# Altium schematic sheet Xiao esp32.SchDoc
size A; SheetNumber: 1; SheetTotal: 1
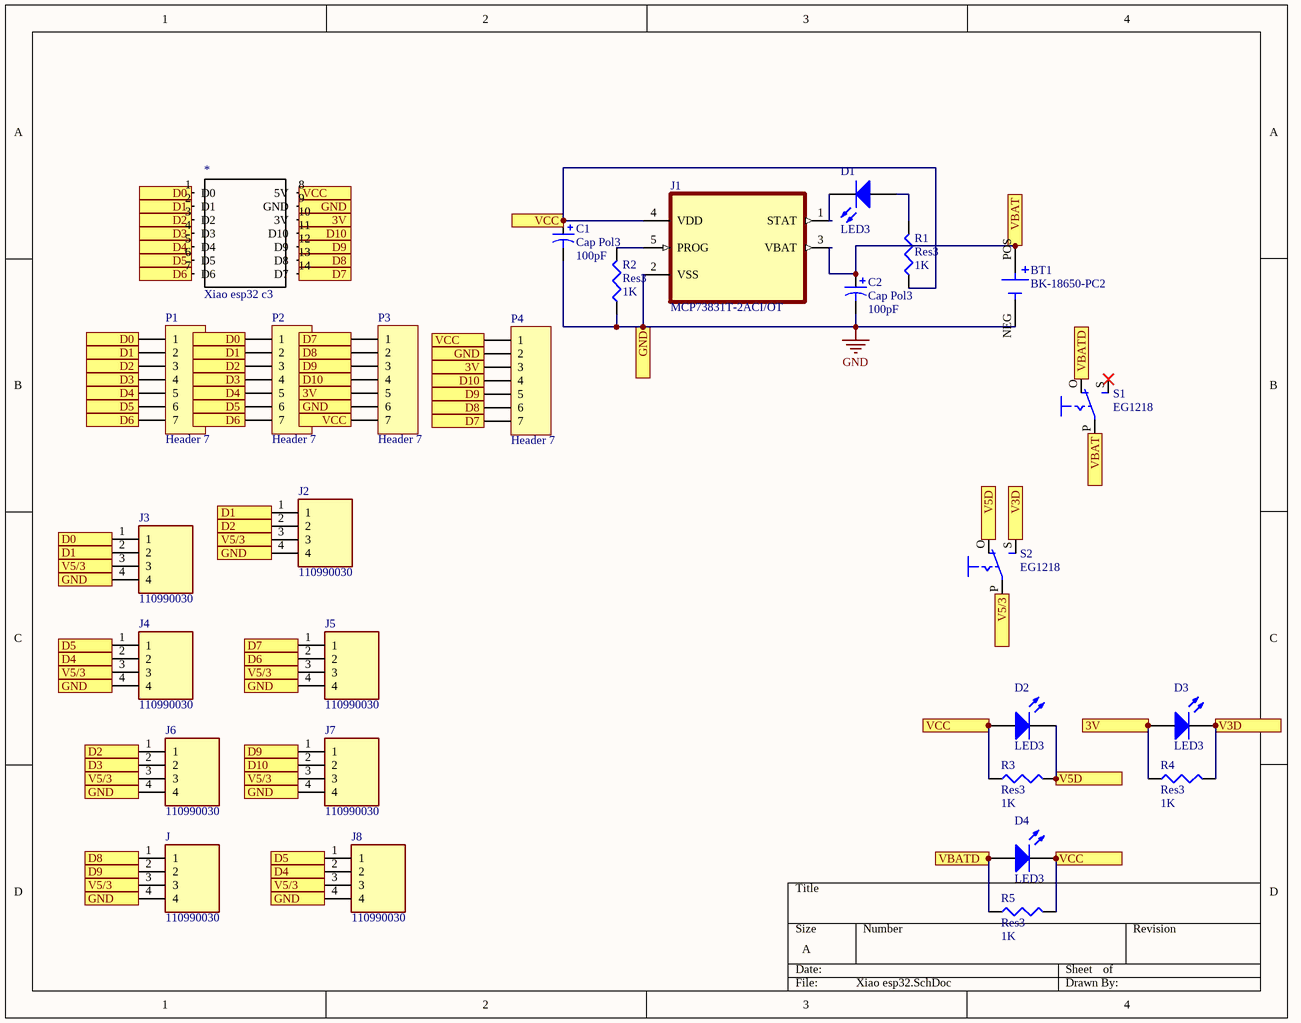
[diagram p0: Xiao esp32.SchDoc]

## Parts
*  Xiao esp32 c3  [Xiao esp32c3]
BT1  BK-18650-PC2  [BAT_BK-18650-PC2]
C1  Cap Pol3  value 100pF  [C0805]
C2  Cap Pol3  value 100pF  [C0805]
D1  LED3  [3.5X2.8X1.9]
D2  LED3  [3.5X2.8X1.9]
D3  LED3  [3.5X2.8X1.9]
D4  LED3  [3.5X2.8X1.9]
J  110990030  [SEEED_110990030]
J1  MCP73831T-2ACI/OT  [SOT95P280X145-5N]
J2  110990030  [SEEED_110990030]
J3  110990030  [SEEED_110990030]
J4  110990030  [SEEED_110990030]
J5  110990030  [SEEED_110990030]
J6  110990030  [SEEED_110990030]
J7  110990030  [SEEED_110990030]
J8  110990030  [SEEED_110990030]
P1  Header 7  [HDR1X7]
P2  Header 7  [HDR1X7]
P3  Header 7  [HDR1X7]
P4  Header 7  [HDR1X7]
R1  Res3  value 1K  [J1-0603]
R2  Res3  value 1K  [J1-0603]
R3  Res3  value 1K  [J1-0603]
R4  Res3  value 1K  [J1-0603]
R5  Res3  value 1K  [J1-0603]
S1  EG1218  [EG1218]
S2  EG1218  [EG1218]

## Ports
3V, D0, D1, D2, D3, D4, D5, D6, D7, D8, D9, D10, GND, V3D, V5/3, V5D, VBAT, VBATD, VCC

## Nets
GND: *.9(GND) BT1.NEG C1.2 C2.2 J.4 J1.2(VSS) J2.4 J3.4 J4.4 J5.4 J6.4 J7.4 J8.4 P3.6 P4.2 R2.1 ; port GND
3V: *.10(3V) D3.1(A) P3.5 P4.3 R4.1 ; port 3V
D0: *.1(D0) J3.1 P1.1 P2.1 ; port D0
D1: *.2(D1) J2.1 J3.2 P1.2 P2.2 ; port D1
D2: *.3(D2) J2.2 J6.1 P1.3 P2.3 ; port D2
D3: *.4(D3) J6.2 P1.4 P2.4 ; port D3
D4: *.5(D4) J4.2 J8.2 P1.5 P2.5 ; port D4
D5: *.6(D5) J4.1 J8.1 P1.6 P2.6 ; port D5
D6: *.7(D6) J5.2 P1.7 P2.7 ; port D6
D7: *.14(D7) J5.1 P3.1 P4.7 ; port D7
D8: *.13(D8) J.1 P3.2 P4.6 ; port D8
D9: *.12(D9) J.2 J7.1 P3.3 P4.5 ; port D9
D10: *.11(D10) J7.2 P3.4 P4.4 ; port D10
V3D: D3.2(K) R4.2 S2.S ; port V3D
V5/3: J.3 J2.3 J3.3 J4.3 J5.3 J6.3 J7.3 J8.3 S2.P ; port V5/3
V5D: D2.2(K) R3.2 S2.O ; port V5D
VBAT: BT1.POS C2.1 J1.3(VBAT) S1.P ; port VBAT
VBATD: D4.1(A) R5.1 S1.O ; port VBATD
VCC: *.8(5V) C1.1 D2.1(A) D4.2(K) J1.4(VDD) P3.7 P4.1 R1.1 R3.1 R5.2 ; port VCC
NetD1_1: D1.1(A) R1.2
NetD1_2: D1.2(K) J1.1(STAT)
NetJ1_5: J1.5(PROG) R2.2

Not connected (* = marked no-connect by the designer): S1 S*

## Library data of the parts
BT1 = BK-18650-PC2: Battery Holder (Open) 18650 1 Cell PC Pin; Price: None; Value: *; Package: None; Availability: Unavailable; MP: BK-18650-PC2
C1 C2 = Cap Pol3: Polarized Capacitor (Surface Mount); Published: 8-Jun-2000; LatestRevisionDate: 29-May-2009; LatestRevisionNote: IPC-7351 Footprint Added.; PackageReference: C0805; Publisher: Altium Limited; PackageDescription: Chip Capacitor
D1-D4 = LED3: Typical BLUE SiC LED; Published: 8-Jun-2000; LatestRevisionDate: 17-Dec-2003; LatestRevisionNote: PCB Footprint replaced.; DatasheetVersion: 16-Apr-2002; PackageVersion: 16-Apr-2002; PackageReference: 3.5X2.8X1.9; Publisher: Altium Limited; PackageDescription: SM LED; 2 C-Bend Leads; Body 3.5 x 2.8 x 1.9 mm, inc leads (LxWxH typ)
J J2-J8 = 110990030: GROVE 2MM 4PIN VERT CONN 10PCS; MF: Seeed Technology; Arrow_Electronics-Purchase-URL: https://snapeda.com/shop?store=Arrow+Electronics&id=583576; Availability: Good; Package: None; Price: None; Mouser-Purchase-URL: https://snapeda.com/shop?store=Mouser&id=583576; MP: 110990030; SnapEDA_Link: https://www.snapeda.com/parts/110990030/Seeed%20Technology%20Co.,%20Ltd/view-part/583576/?ref=snap; Value: *
J1 = MCP73831T-2ACI/OT: Charger IC Lithium Ion/Polymer SOT-23-5; MF: Microchip; Package: SOT-23 Microchip; Purchase-URL: https://pricing.snapeda.com/search/part/MCP73831T-2ACI/OT/?ref=eda; MP: MCP73831T-2ACI/OT; Value: *; Availability: In Stock; SnapEDA_Link: https://www.snapeda.com/parts/MCP73831T-2ACI/OT/Microchip/view-part/?ref=snap; Price: None; Check_prices: https://www.snapeda.com/parts/MCP73831T-2ACI/OT/Microchip/view-part/?ref=eda
P1-P4 = Header 7: Header, 7-Pin; LatestRevisionDate: 17-Jul-2002; LatestRevisionNote: Re-released for DXP Platform.; Publisher: Altium Limited
R1-R5 = Res3: Resistor; Published: 8-Jun-2000; LatestRevisionDate: 29-May-2009; LatestRevisionNote: IPC-7351 Footprint Added.; PackageReference: J1-0603; Publisher: Altium Limited; PackageDescription: Chip Resistor
S1 S2 = EG1218: Slide Switch SPDT Through Hole; MF: E-Switch; Purchase-URL: https://pricing.snapeda.com/search/part/EG1218/?ref=eda; Package: None; Availability: In Stock; MP: EG1218; Value: *; Check_prices: https://www.snapeda.com/parts/EG1218/E-Switch/view-part/?ref=eda; SnapEDA_Link: https://www.snapeda.com/parts/EG1218/E-Switch/view-part/?ref=snap; Price: None